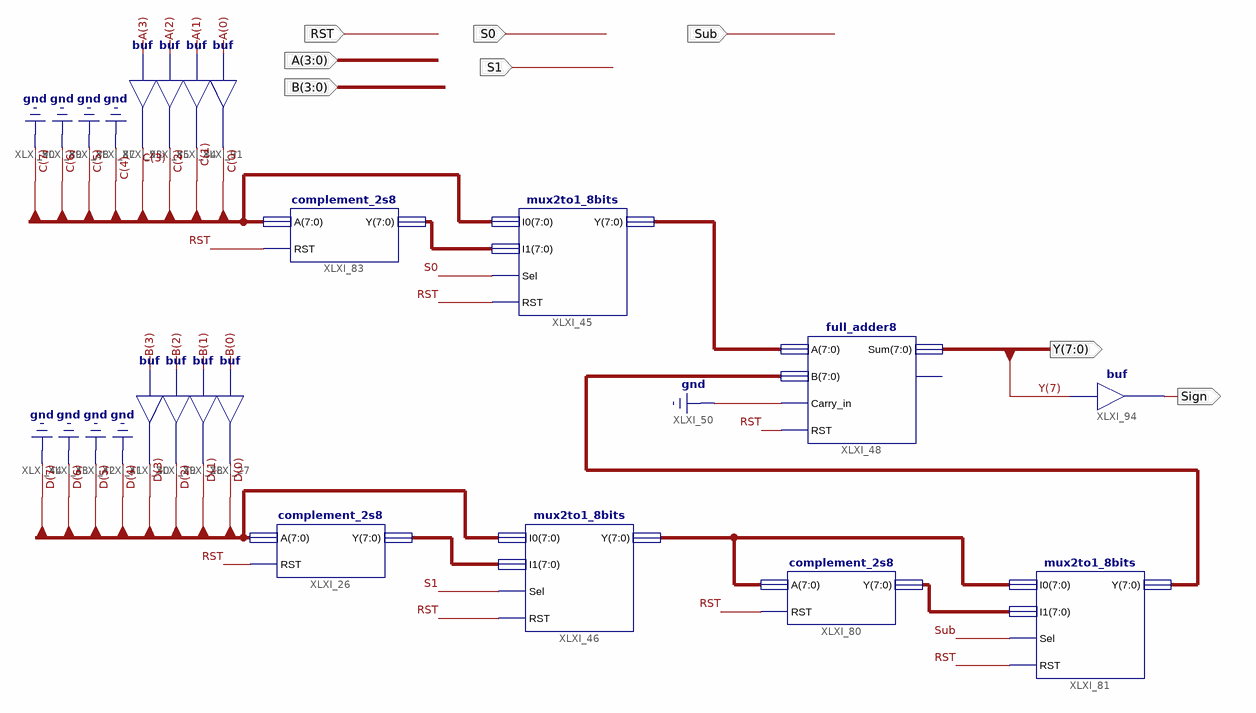
[diagram p0: schematic sheet 1]
// Xilinx ISE schematic addition_subtraction_block.sch (artix7) as structural Verilog: 16 symbols, 8 ports
module addition_subtraction_block (
  input  RST,
  input  S0,
  input  S1,
  input  Sub,
  input  [3:0] A,
  input  [3:0] B,
  output [7:0] Y,
  output Sign
);

  wire [3:0] C, D;
  wire [7:0] C_bar, D_bar, XLXN_58, XLXN_117, XLXN_122, XLXN_141;

  complement_2s8 XLXI_26 (.A({4'b0000, D}), .RST(RST), .Y(D_bar));
  buf XLXI_27 (D[0], B[0]);
  buf XLXI_28 (D[1], B[1]);
  buf XLXI_29 (D[2], B[2]);
  buf XLXI_30 (D[3], B[3]);
  mux2to1_8bits XLXI_46 (.I0({4'b0000, D}), .I1(D_bar), .RST(RST), .Sel(S1), .Y(XLXN_117));
  mux2to1_8bits XLXI_45 (.I0({4'b0000, C}), .I1(C_bar), .RST(RST), .Sel(S0), .Y(XLXN_58));
  full_adder8 XLXI_48 (.A(XLXN_58), .B(XLXN_141), .Carry_in(1'b0), .RST(RST), .Sum(Y));  // open: Carry_out
  complement_2s8 XLXI_80 (.A(XLXN_117), .RST(RST), .Y(XLXN_122));
  mux2to1_8bits XLXI_81 (.I0(XLXN_117), .I1(XLXN_122), .RST(RST), .Sel(Sub), .Y(XLXN_141));
  complement_2s8 XLXI_83 (.A({4'b0000, C}), .RST(RST), .Y(C_bar));
  buf XLXI_84 (C[1], A[1]);
  buf XLXI_85 (C[2], A[2]);
  buf XLXI_91 (C[0], A[0]);
  buf XLXI_93 (C[3], A[3]);
  buf XLXI_94 (Sign, Y[7]);
endmodule
